# Altium project Joystick.PrjPcb
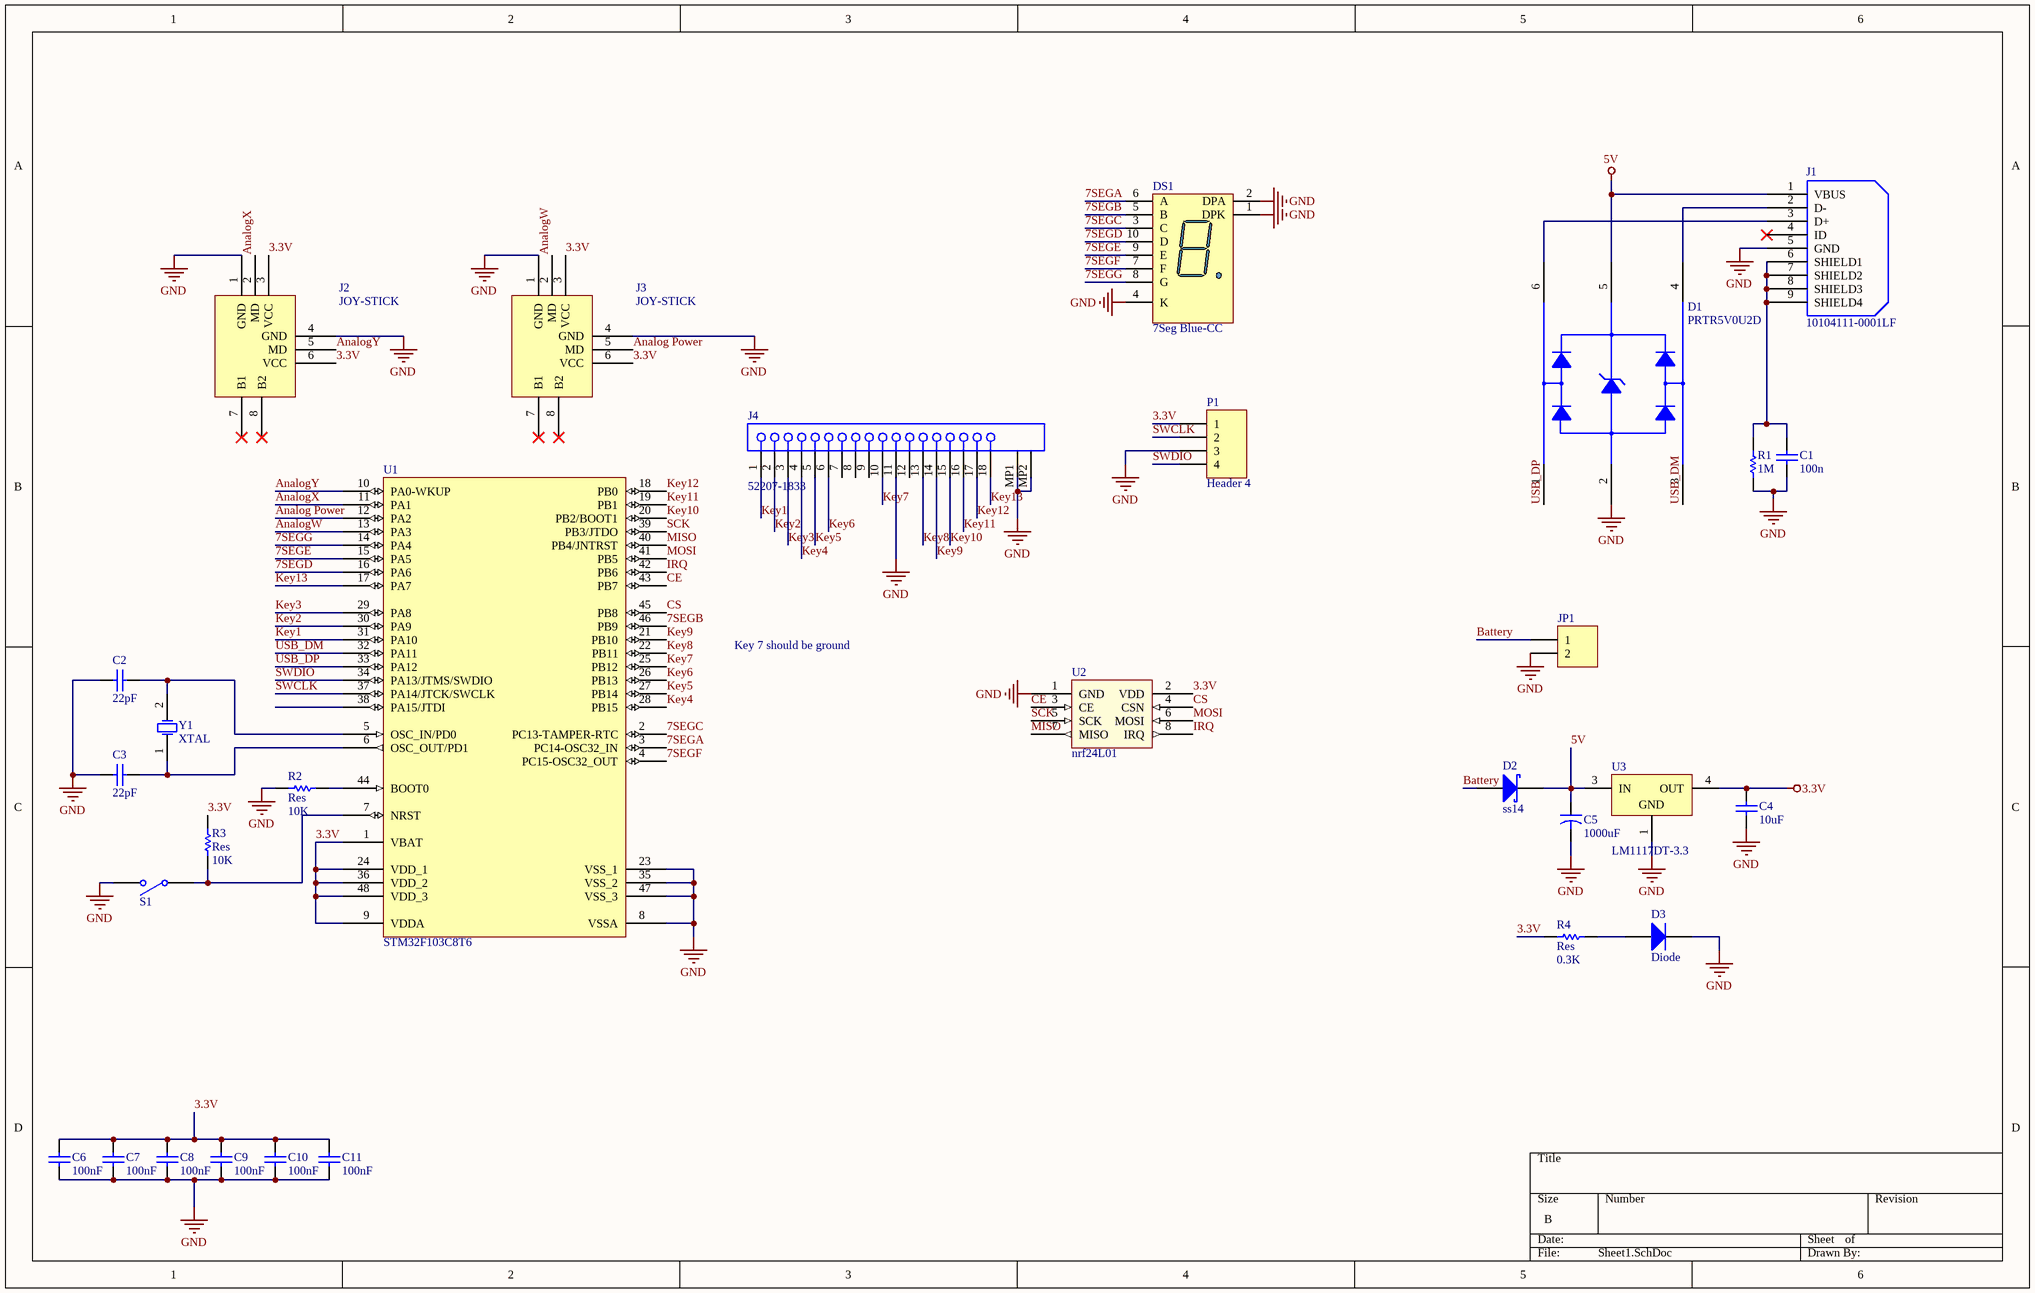
[diagram p0: Sheet1.SchDoc]
1 sheet, 30 parts. Net scope: global (net labels, ports and power ports of the same name join across sheets).
Board file: PCB1.PcbDoc

## Sheet Sheet1.SchDoc
size B

### Parts
C1  100n  [6-0805_N]
C2  value 22pF  [2012[0805]]  (hidden comment: Cap_UP)
C3  value 22pF  [2012[0805]]  (hidden comment: Cap_UP)
C4  value 10uF  [2012[0805]]  (hidden comment: Cap_UP)
C5  value 1000uF  [7343]  (hidden comment: Cap_El)
C6  value 100nF  [2012[0805]]  (hidden comment: Cap_UP)
C7  value 100nF  [2012[0805]]  (hidden comment: Cap_UP)
C8  value 100nF  [2012[0805]]  (hidden comment: Cap_UP)
C9  value 100nF  [2012[0805]]  (hidden comment: Cap_UP)
C10  value 100nF  [2012[0805]]  (hidden comment: Cap_UP)
C11  value 100nF  [2012[0805]]  (hidden comment: Cap_UP)
D1  value PRTR5V0U2D  [PRTR5V0U2D]  (hidden comment: PRTR5V0U2X)
D2  ss14  [US1m]
D3  Diode  [2012[0805]]
DS1  7Seg Blue-CC  [7Segment Small]
J1  value 10104111-0001LF  [USB_MINI]  (hidden comment: USB_AB)
J2  JOY-STICK  [JOY STICK]
J3  JOY-STICK  [JOY STICK]
J4  52207-1833  [MOLX-52207-1833]
JP1  Header 2  [HDR1X2A]  (value not drawn)
P1  Header 4  [HDR1X4]
R1  1M  [2012[0805]]
R2  Res  value 10K  [2012[0805]]
R3  Res  value 10K  [2012[0805]]
R4  Res  value 0.3K  [2012[0805]]
S1  SW-SPST  [SW-SMD]  (value not drawn)
U1  STM32F103C8T6  [LQFP48_N]
U2  nrf24L01  [NRF24L01]
U3  LM1117DT-3.3  [SOT223]
Y1  XTAL  [R38]

### Nets
3.3V: C4.2 C6.2 C7.2 C8.2 C9.2 C10.2 C11.2 J2.3(VCC) J2.6(VCC) J3.3(VCC) J3.6(VCC) P1.1 R3.2 R4.1 U1.1(VBAT) U1.9(VDDA) U1.24(VDD_1) U1.36(VDD_2) U1.48(VDD_3) U2.2(VDD) U3.4(OUT)
5V: C5.1 D1.5(VCC) D2.2(K) J1.1(VBUS) U3.3(IN)
GND: C1.1 C2.1 C3.1 C4.1 C5.2 C6.1 C7.1 C8.1 C9.1 C10.1 C11.1 D1.2(GND) D3.2(K) DS1.1(DPK) DS1.2(DPA) DS1.4(K) J1.5(GND) J2.1(GND) J2.4(GND) J3.1(GND) J3.4(GND) J4.11 J4.MP1 J4.MP2 JP1.2 P1.3 R1.1 R2.1 S1.2(NO) U1.8(VSSA) U1.23(VSS_1) U1.35(VSS_2) U1.47(VSS_3) U2.1(GND) U3.1(GND)
7SEGA: DS1.6(A) U1.3(PC14-OSC32_IN)
7SEGB: DS1.5(B) U1.46(PB9)
7SEGC: DS1.3(C) U1.2(PC13-TAMPER-RTC)
7SEGD: DS1.10(D) U1.16(PA6)
7SEGE: DS1.9(E) U1.15(PA5)
7SEGF: DS1.7(F) U1.4(PC15-OSC32_OUT)
7SEGG: DS1.8(G) U1.14(PA4)
Analog Power: J3.5(MD) U1.12(PA2)
AnalogW: J3.2(MD) U1.13(PA3)
AnalogX: J2.2(MD) U1.11(PA1)
AnalogY: J2.5(MD) U1.10(PA0-WKUP)
Battery: D2.1(A) JP1.1
CE: U1.43(PB7) U2.3(CE)
CS: U1.45(PB8) U2.4(CSN)
IRQ: U1.42(PB6) U2.8(IRQ)
Key1: J4.1 U1.31(PA10)
Key2: J4.2 U1.30(PA9)
Key3: J4.3 U1.29(PA8)
Key4: J4.4 U1.28(PB15)
Key5: J4.5 U1.27(PB14)
Key6: J4.6 U1.26(PB13)
Key7: J4.10 U1.25(PB12)
Key8: J4.13 U1.22(PB11)
Key9: J4.14 U1.21(PB10)
Key10: J4.15 U1.20(PB2/BOOT1)
Key11: J4.16 U1.19(PB1)
Key12: J4.17 U1.18(PB0)
Key13: J4.18 U1.17(PA7)
MISO: U1.40(PB4/JNTRST) U2.7(MISO)
MOSI: U1.41(PB5) U2.6(MOSI)
SCK: U1.39(PB3/JTDO) U2.5(SCK)
SWCLK: P1.2 U1.37(PA14/JTCK/SWCLK)
SWDIO: P1.4 U1.34(PA13/JTMS/SWDIO)
USB_DM: D1.3(I/O2) U1.32(PA11)
USB_DP: D1.1(I/O_1) U1.33(PA12)
NetC1_2: C1.2 J1.6(SHIELD1) J1.7(SHIELD2) J1.8(SHIELD3) J1.9(SHIELD4) R1.2
NetC2_2: C2.2 U1.5(OSC_IN/PD0) Y1.2(OSC2)
NetC3_2: C3.2 U1.6(OSC_OUT/PD1) Y1.1(OSC1)
NetD1_4: D1.4(I/O2) J1.2(D-)
NetD1_6: D1.6(I/O1) J1.3(D+)
NetD3_1: D3.1(A) R4.2
NetR2_2: R2.2 U1.44(BOOT0)
NetR3_1: R3.1 S1.1(COMMON) U1.7(NRST)

Not connected (* = marked no-connect by the designer): J1 4(ID)*; J2 7(B1)* 8(B2)*; J3 7(B1)* 8(B2)*; J4 7 8 9 12; U1 38(PA15/JTDI)

### Notes on the sheet
- Key 7 should be ground

### Library data of the parts
C1 = Cap: Capacitor; Published: 8-Jun-2000; LatestRevisionDate: 17-Jul-2002; LatestRevisionNote: Re-released for DXP Platform.; PackageReference: RAD-0.3; Publisher: Altium Limited; PackageDescription: Radial Cap, Thru-Hole; 2 Leads; 0.3 in Pin Spacing; Value: 100n
C2-C4 C6-C11 = Cap_UP: Capacitor; Published: 8-Jun-2000; LatestRevisionDate: 17-Jul-2002; LatestRevisionNote: Re-released for DXP Platform.; PackageReference: RAD-0.3; Publisher: Altium Limited
C5 = Cap_El: Capacitor; Published: 23-Sep-2002; PackageReference: CAPR5-4X5; Publisher: Altium Limited
D1 = PRTR5V0U2D: Double rail-to-rail USB ESD protection diode; OrcadPartType: Integrated Circuits&Special function&Protection; Manufacturer: Philips; AN: A06-0236; TemperatureRange: -40 to +85 C; PartType: Buy; Height: 1,10000002384186; MPN: PRTR5V0U2X
D2 = D Schottky: Schottky Diode; Published: 8-Jun-2000; LatestRevisionDate: 17-Jul-2002; LatestRevisionNote: Re-released for DXP Platform.; PackageReference: SMB; Publisher: Altium Limited; PackageDescription: DO-214-AA/SMB; 2 C-Bend Leads; Body 5.3 x 3.6 mm, inc. leads (LxW); Code_JEDEC: DO-214-AA
D3 = Diode: 1 Amp General Purpose Rectifier; Revision 1: 11-Jul-2000: SIM Model Added.; Revision 2: 17-Jul-2002: Re-released for DXP Platform.; Package Information: Latest Revision: Aug-1999; Code - JEDEC: DO-204-AL; Published: 8-Jun-2000; Datasheet: Latest Revision: 1998; Package Reference: DO-41; Publisher: Altium Limited
DS1 = 7Seg Blue-CC_1: 14.2 mm General Purpose Blue 7-Segment Display: CC, RH DP, Gray Surface; MinimumIntensity: 2020 ucd; Note: IF = 10 mA; Published: 8-Jun-2000; LatestRevisionDate: 17-Dec-2003; LatestRevisionNote: Schematic revised, PCB Footprint replaced.; DatasheetDocument: 24-Sep-2002; PackageDocument: 24-Sep-2002; PackageReference: H; Publisher: Altium Limited; Colour: Blue; ComponentLink1Description: Manufacturer Link; ComponentLink1URL: http://www.agilent.com/
J1 = USB_AB: Micro USB AB Connector; PartGroup: Mechanical devices,Connectors,USB; Manufacturer: FCI; AN: A08-1368; Height: 2.59999990463257; MPN: 10104111-0001LF
J2 J3 = JOY STICK
J4 = 52207-1833: 1.0 mm Pitch Easy-On(TM) Type FPC Connector, 2.7 mm Mated Height, Right Angle, ZIF, SMT, Top Contact, 18 Circuits, -40 to 85 degC, ELV and RoHS Compliant, Tape and Reel; Manufacturer: Molex; Circuits (Loaded): 18; Current (Max per Contact): 1A; Durability (mating cycles max): 30; Entry Angle: 90degrees Angle; Mated Height: 2.70mm; Material - Metal: Phosphor Bronze; Material - Plating Mating: Silver, Tin-Bismuth; PCB Locator: No; PCB Retention: Yes; Pitch - Mating Interface: 1.00mm; Voltage (Max): 125V; PackageVersion: Rev. B, 08/2013; PackageReference: 52207-1833; PackageDescription: 18-Lead FPC Connector, Pitch 1.0 mm; Supplier 1: Farnell; Supplier Part Number 1: 2361296; Supplier 2: Farnell; Supplier Part Number 2: 2361335; Supplier 3: Mouser; Supplier Part Number 3: 538-52207-1833; Contact Position: Top; Material - Plating Termination: Silver, Tin-Bismuth; Number of Rows: 1; Orientation: Right Angle; Packing: Tape and Reel; Pitch - Termination Interface: 1.00mm; Polarized to PCB: Yes; RoHS: TRUE; Stackable: No; Mounting Technology: Surface Mount; PartNumber: 52207-1833; ComponentLink1Description: Manufacturer URL; ComponentLink1URL: http://www.molex.com/molex/index.jsp; ComponentLink2Description: Datasheet; ComponentLink2URL: http://www.molex.com/webdocs/datasheets/pdf/en-us/0522071833_FFC_FPC_CONNECTORS.pdf; ComponentLink3Description: Package Specification; ComponentLink3URL: http://www.molex.com/pdm_docs/sd/522071833_sd.pdf
JP1 = Header 2: Header, 2-Pin; Revision: 17-Jul-2002: Re-released for DXP Platform.; Publisher: Altium Limited
P1 = Header 4: Header, 4-Pin; LatestRevisionDate: 17-Jul-2002; LatestRevisionNote: Re-released for DXP Platform.; Publisher: Altium Limited
R1-R4 = Res: Semiconductor Resistor; Published: 8-Jun-2000; LatestRevisionDate: 17-Jul-2002; LatestRevisionNote: Re-released for DXP Platform.; PackageReference: AXIAL-0.5; Publisher: Altium Limited
  R1: Value: 1M
S1 = SW-SPST: Single-Pole, Single-Throw Switch; Published: 24-Mar-1999; Revision: July-2002: Re-released for DXP Platform.; Publisher: Altium Limited
U1 = STM32F103C8T6: STM32 ARM-based 32-bit MCU with 64 Kbytes Flash, 48-pin LQFP, Industrial Temperature; Published: 30-May-2008; DatasheetVersion: rev6, Mar-2008; PackageVersion: Mar-2008; PackageReference: LQFP48; Publisher: Altium Limited; PackageDescription: 48-Pin Low-Profile Quad Flat Pack, 7 x 7 mm Body, 0.5 mm Pitch (LQFP48); ComponentLink1Description: Manufacturer Link; ComponentLink1URL: www.st.com/stm32; ComponentLink2Description: Datasheet; ComponentLink2URL: http://www.st.com/stonline/products/literature/ds/13587.pdf
U3 = LM1117DT-3.3: 800mA Low-Dropout Linear Regulator, 3-pin TO-252; Manufacturer: National Semiconductor; PackageTopMarking: NSUZXYTT*LM1117*DT-3.3; PowerWise: N; CompType: LDO IC; Published: 4-Dec-2008; DatasheetVersion: Apr-2006; PackageVersion: revD, Feb-2009; PackageReference: TD03B; Publisher: Altium Limited; PackageDescription: TO252, Molded, Jedec, 6.8 x 6.10 x 2.30mm Body, 3 Lead, 2.28mm Pitch, Surface Mount; Supplier 1: Farnell; Supplier Part Number 1: 9486275; Supplier 2: Farnell; Supplier Part Number 2: 1523829; PartNumber: LM1117DT-3.3; RoHS: N; PinCount: 3; Code_JEDEC: TO-252-AA; ComponentLink1Description: LM1117 Datasheet; ComponentLink1URL: http://www.national.com/ds/LM/LM1117.pdf; ComponentLink2Description: LM1117 Web Page; ComponentLink2URL: http://www.national.com/pf/LM/LM1117.html; ComponentLink3Description: TD03B Package Page; ComponentLink3URL: http://www.national.com/packaging/folders/td03b.html
Y1 = XTAL: Crystal Oscillator; Published: 8-Jun-2000; LatestRevisionDate: 17-Jul-2002; LatestRevisionNote: Re-released for DXP Platform.; PackageReference: R38; Publisher: Altium Limited